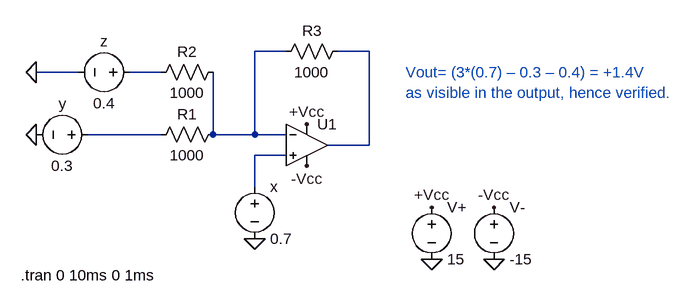
[diagram p0: schematic 2017AAPS1734H_Run1.asc]
2017AAPS1734H_Run1.asc, the LTspice schematic file:
Version 4
SHEET 1 1204 680
WIRE 144 16 96 16
WIRE 272 16 224 16
WIRE -176 48 -240 48
WIRE -48 48 -96 48
WIRE -48 144 -160 144
WIRE 32 144 32 48
WIRE 96 144 96 16
WIRE 96 144 32 144
WIRE 144 144 96 144
WIRE 272 160 272 16
WIRE 272 160 208 160
WIRE 144 176 96 176
WIRE 96 224 96 176
FLAG 368 336 0
FLAG 464 336 0
FLAG 368 256 +Vcc
FLAG 464 256 -Vcc
FLAG 176 192 -Vcc
FLAG 176 128 +Vcc
FLAG -240 48 0
FLAG -240 144 0
FLAG 96 304 0
SYMBOL Opamps\\UniversalOpamp2 176 160 R0
SYMATTR InstName U1
SYMBOL voltage 368 240 R0
WINDOW 123 0 0 Left 0
WINDOW 39 24 124 Left 2
SYMATTR InstName V+
SYMATTR Value 15
SYMBOL voltage 464 240 R0
SYMATTR InstName V-
SYMATTR Value -15
SYMBOL res 48 128 R90
WINDOW 0 0 56 VBottom 2
WINDOW 3 32 56 VTop 2
SYMATTR InstName R1
SYMATTR Value 1000
SYMBOL res 48 32 R90
WINDOW 0 0 56 VBottom 2
WINDOW 3 32 56 VTop 2
SYMATTR InstName R2
SYMATTR Value 1000
SYMBOL res 240 0 R90
WINDOW 0 0 56 VBottom 2
WINDOW 3 32 56 VTop 2
SYMATTR InstName R3
SYMATTR Value 1000
SYMBOL voltage 96 208 R0
WINDOW 123 0 0 Left 0
WINDOW 39 0 0 Left 0
SYMATTR InstName x
SYMATTR Value 0.7
SYMBOL voltage -80 48 R90
WINDOW 0 -32 56 VBottom 2
WINDOW 3 32 56 VTop 2
WINDOW 123 0 0 Left 0
WINDOW 39 0 0 Left 0
SYMATTR InstName z
SYMATTR Value 0.4
SYMBOL voltage -144 144 R90
WINDOW 0 -32 56 VBottom 2
WINDOW 3 32 56 VTop 2
WINDOW 123 0 0 Left 0
WINDOW 39 0 0 Left 0
SYMATTR InstName y
SYMATTR Value 0.3
TEXT -264 360 Left 2 !.tran 0 10ms 0 1ms
TEXT 328 48 Left 2 ;Vout= (3*(0.7) – 0.3 – 0.4) = +1.4V\nas visible in the output, hence verified.

The netlist it stands for:
* 2017AAPS1734H_Run1.asc
XU1 N005 N001 +Vcc -Vcc N002 level.2 Avol=1Meg GBW=10Meg Slew=10Meg ilimit=25m rail=0 Vos=0 phimargin=45 en=0 enk=0 in=0 ink=0 Rin=500Meg  ; pins IN+ IN- V+ V- OUT
V+ +Vcc 0 15
V- -Vcc 0 -15
R1 N001 N004 1000
R2 N001 N003 1000
R3 N002 N001 1000
V§x N005 0 0.7
V§z N003 0 0.4
V§y N004 0 0.3
.tran 0 10ms 0 1ms
* Vout= (3*(0.7) – 0.3 – 0.4) = +1.4V
* as visible in the output, hence verified.
.lib UniversalOpamps2.sub
.backanno
.end